# Altium schematic sheet STM32.SchDoc
size B
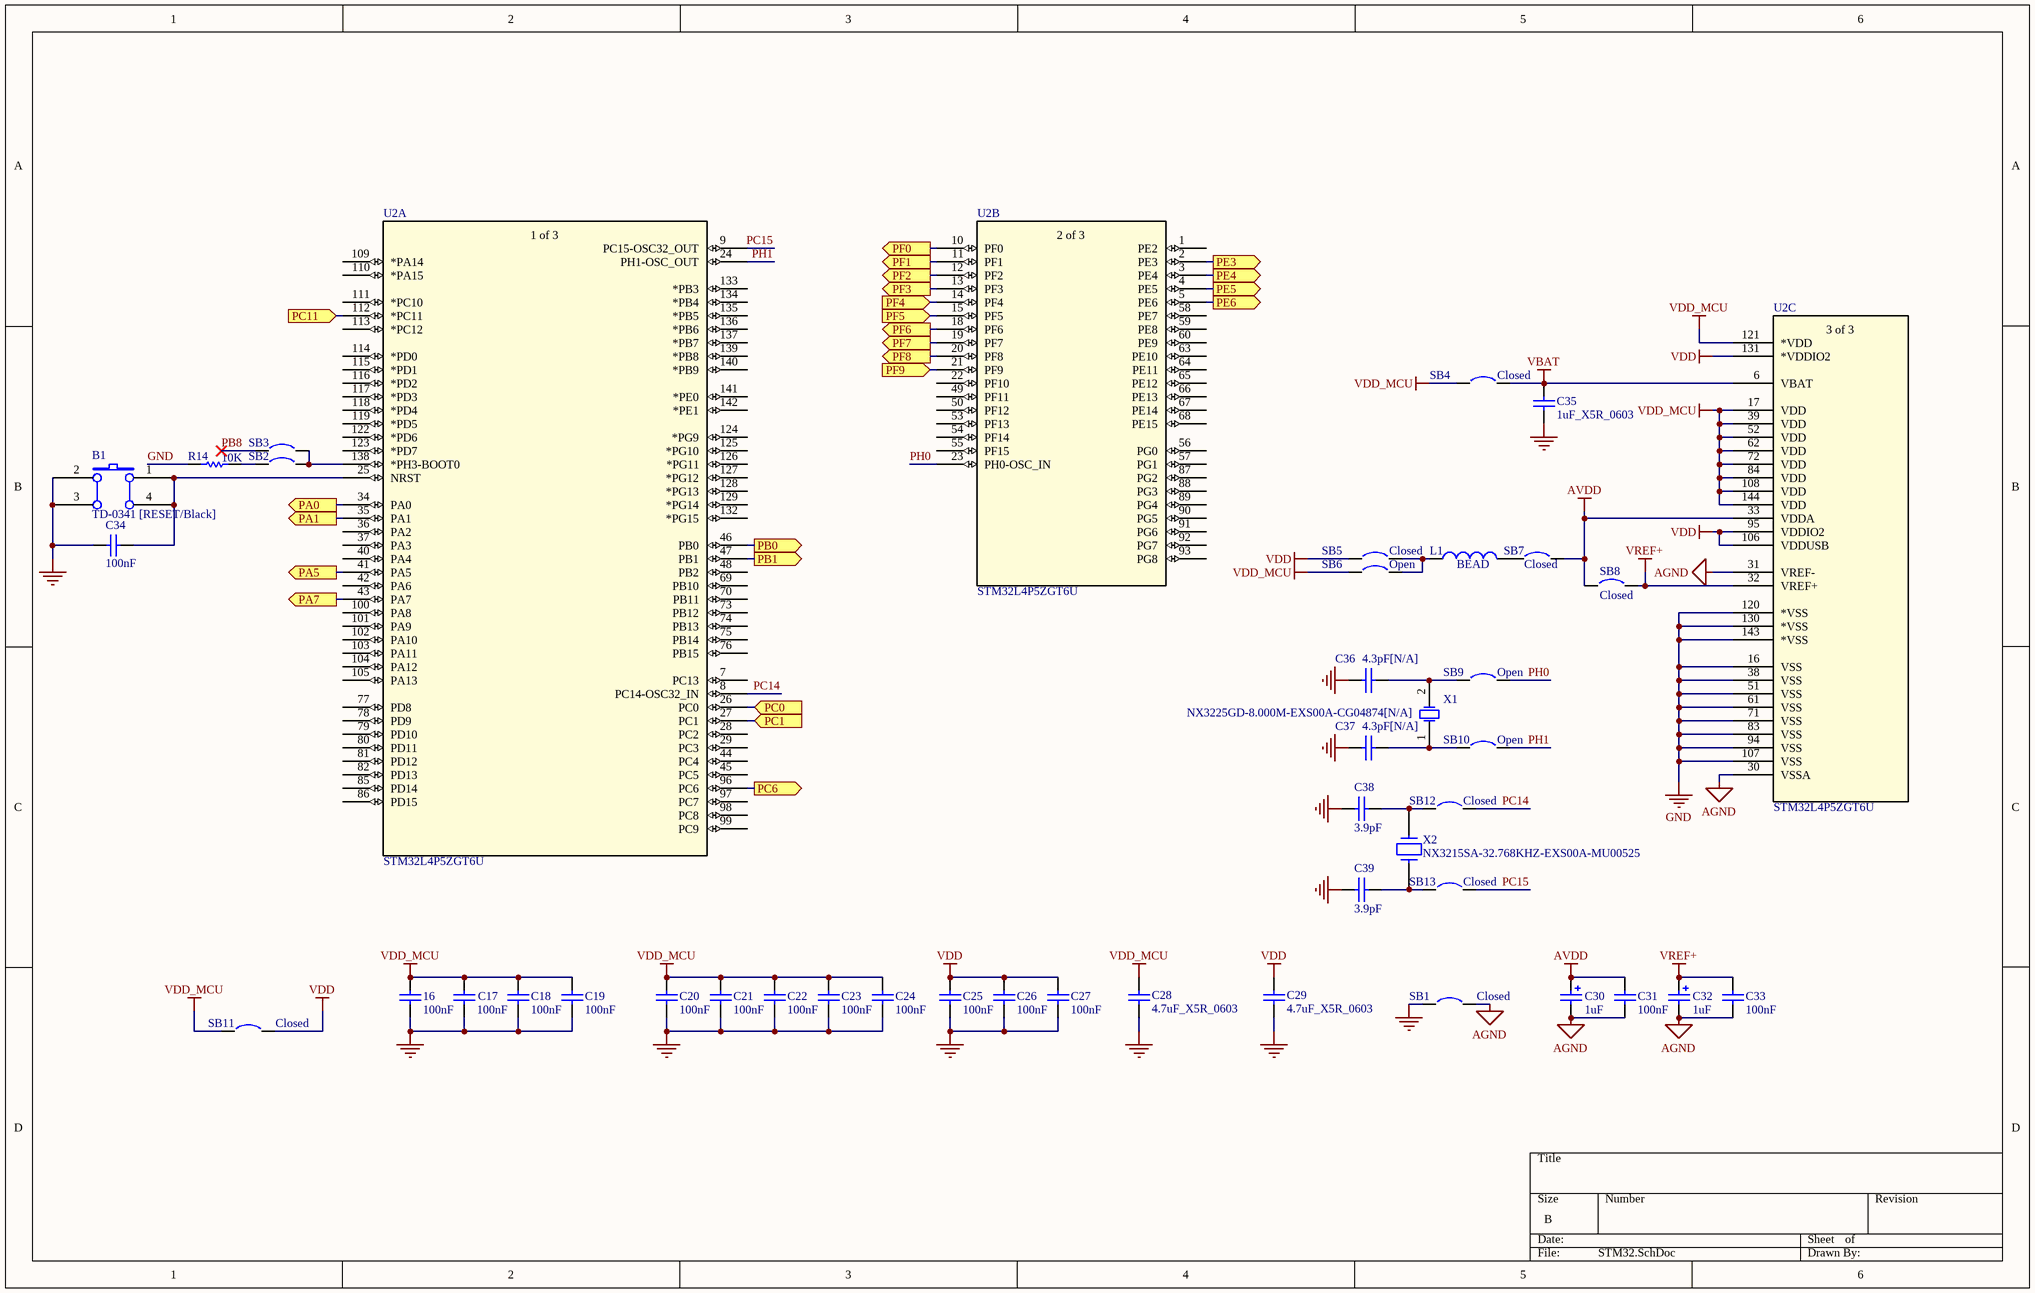
[diagram p0: STM32.SchDoc]

## Parts
16  100nF  [0603C]
B1  TD-0341 [RESET/Black]  [PB-6X6mm-Black]
C17  100nF  [0603C]
C18  100nF  [0603C]
C19  100nF  [0603C]
C20  100nF  [0603C]
C21  100nF  [0603C]
C22  100nF  [0603C]
C23  100nF  [0603C]
C24  100nF  [0603C]
C25  100nF  [0603C]
C26  100nF  [0603C]
C27  100nF  [0603C]
C28  4.7uF_X5R_0603  [0603C]
C29  4.7uF_X5R_0603  [0603C]
C30  value 1uF  [TAN-A]  (hidden comment: TAJA105K016R)
C31  100nF  [0603C]
C32  value 1uF  [TAN-A]  (hidden comment: TAJA105K016R)
C33  100nF  [0603C]
C34  100nF  [0603C]
C35  1uF_X5R_0603  [0603C]
C36  4.3pF[N/A]  [0603C]
C37  4.3pF[N/A]  [0603C]
C38  3.9pF  [0603C]
C39  3.9pF  [0603C]
L1  BEAD  [0603L]
R14  10K  [0603R]
SB1  Closed  [SB_0603]
SB2  Circuit Breaker  [SB_0603]  (value not drawn)
SB3  Circuit Breaker  [SB_0603]  (value not drawn)
SB4  Closed  [SB_0603]
SB5  Closed  [SB_0603]
SB6  Open  [SB_0603]
SB7  Closed  [SB_0603]
SB8  Closed  [SB_0603]
SB9  Open  [SB_0603]
SB10  Open  [SB_0603]
SB11  Closed  [SB_0603]
SB12  Closed  [SB_0603]
SB13  Closed  [SB_0603]
U2  STM32L4P5ZGT6U  [LQFP144_STM32_STM]  (parts A,B,C of 3)
X1  NX3225GD-8.000M-EXS00A-CG04874[N/A]  [OSC_2SM_3R2x2R5]
X2  NX3215SA-32.768KHZ-EXS00A-MU00525  [XTAL_2SM_3R2X1R5]

## Ports
PA0 (out), PA1 (out), PA5 (out), PA7 (out), PB0 (out), PB1 (out), PC0 (in), PC1 (in), PC6 (out), PC11 (in), PE3 (out), PE4 (out), PE5 (out), PE6 (out), PF0 (out), PF1 (out), PF2 (out), PF3 (out), PF4 (in), PF5 (in), PF6 (out), PF7 (out), PF8 (out), PF9 (in)

## Nets
AGND: C30.2 C31.2 C32.2 C33.2 SB1.2 U2.30(VSSA) U2.31(VREF-)
AVDD: C30.1 C31.1 SB7.2 SB8.1 U2.33(VDDA)
GND: 16.2 B1.2(B0) B1.3(B1) C17.2 C18.2 C19.2 C20.2 C21.2 C22.2 C23.2 C24.2 C25.2 C26.2 C27.2 C28.2 C29.2 C34.2 C35.2 C36.2 C37.2 C38.2 C39.2 R14.2 SB1.1 U2.16(VSS) U2.38(VSS) U2.51(VSS) U2.61(VSS) U2.71(VSS) U2.83(VSS) U2.94(VSS) U2.107(VSS) U2.120(*VSS) U2.130(*VSS) U2.143(*VSS)
VBAT: C35.1 SB4.2 U2.6(VBAT)
VDD: C25.1 C26.1 C27.1 C29.1 SB5.1 SB11.2 U2.95(VDDIO2) U2.106(VDDUSB) U2.131(*VDDIO2)
VDD_MCU: 16.1 C17.1 C18.1 C19.1 C20.1 C21.1 C22.1 C23.1 C24.1 C28.1 SB4.1 SB6.1 SB11.1 U2.17(VDD) U2.39(VDD) U2.52(VDD) U2.62(VDD) U2.72(VDD) U2.84(VDD) U2.108(VDD) U2.121(*VDD) U2.144(VDD)
VREF+: C32.1 C33.1 SB8.2 U2.32(VREF+)
PA0: U2.34(PA0) ; port PA0
PA1: U2.35(PA1) ; port PA1
PA5: U2.41(PA5) ; port PA5
PA7: U2.43(PA7) ; port PA7
PB0: U2.46(PB0) ; port PB0
PB1: U2.47(PB1) ; port PB1
PB8: SB3.1
PC0: U2.26(PC0) ; port PC0
PC1: U2.27(PC1) ; port PC1
PC6: U2.96(PC6) ; port PC6
PC11: U2.112(*PC11) ; port PC11
PC14: SB12.2 U2.8(PC14-OSC32_IN)
PC15: SB13.2 U2.9(PC15-OSC32_OUT)
PE3: U2.2(PE3) ; port PE3
PE4: U2.3(PE4) ; port PE4
PE5: U2.4(PE5) ; port PE5
PE6: U2.5(PE6) ; port PE6
PF0: U2.10(PF0) ; port PF0
PF1: U2.11(PF1) ; port PF1
PF2: U2.12(PF2) ; port PF2
PF3: U2.13(PF3) ; port PF3
PF4: U2.14(PF4) ; port PF4
PF5: U2.15(PF5) ; port PF5
PF6: U2.18(PF6) ; port PF6
PF7: U2.19(PF7) ; port PF7
PF8: U2.20(PF8) ; port PF8
PF9: U2.21(PF9) ; port PF9
PH0: SB9.2 U2.23(PH0-OSC_IN)
PH1: SB10.2 U2.24(PH1-OSC_OUT)
NetB1_1: B1.1(A0) B1.4(A1) C34.1 U2.25(NRST)
NetC36_1: C36.1 SB9.1 X1.2(OSC2)
NetC37_1: C37.1 SB10.1 X1.1(OSC1)
NetC38_1: C38.1 SB12.1 X2.1
NetC39_1: C39.1 SB13.1 X2.2
NetL1_1: L1.1 SB5.2 SB6.2
NetL1_2: L1.2 SB7.1
NetR14_1: R14.1 SB2.1
NetSB2_2: SB2.2 SB3.2 U2.138(*PH3-BOOT0)

Not connected (* = marked no-connect by the designer): U2 1(PE2) 7(PC13) 22(PF10) 28(PC2) 29(PC3) 36(PA2) 37(PA3) 40(PA4) 42(PA6) 44(PC4) 45(PC5) 48(PB2) 49(PF11) 50(PF12) 53(PF13) 54(PF14) 55(PF15) 56(PG0) 57(PG1) 58(PE7) 59(PE8) 60(PE9) 63(PE10) 64(PE11) 65(PE12) 66(PE13) 67(PE14) 68(PE15) 69(PB10) 70(PB11) 73(PB12) 74(PB13) 75(PB14) 76(PB15) 77(PD8) 78(PD9) 79(PD10) 80(PD11) 81(PD12) 82(PD13) 85(PD14) 86(PD15) 87(PG2) 88(PG3) 89(PG4) 90(PG5) 91(PG6) 92(PG7) 93(PG8) 97(PC7) 98(PC8) 99(PC9) 100(PA8) 101(PA9) 102(PA10) 103(PA11) 104(PA12) 105(PA13) 109(*PA14) 110(*PA15) 111(*PC10) 113(*PC12) 114(*PD0) 115(*PD1) 116(*PD2) 117(*PD3) 118(*PD4) 119(*PD5) 122(*PD6) 123(*PD7) 124(*PG9) 125(*PG10) 126(*PG11) 127(*PG12) 128(*PG13) 129(*PG14) 132(*PG15) 133(*PB3) 134(*PB4) 135(*PB5) 136(*PB6) 137(*PB7) 139(*PB8) 140(*PB9) 141(*PE0) 142(*PE1)

## Notes on the sheet
- (in symbol STM32L4P5ZGT6U, part A) 1 of 3
- (in symbol STM32L4P5ZGT6U, part B) 2 of 3
- (in symbol STM32L4P5ZGT6U, part C) 3 of 3

## Library data of the parts
16 C17-C27 C31 C33 = Cap: Capacitor; Value: 10nF; Published: 8-Jun-2000; Revision: July-2002: Re-released for DXP Platform.; Publisher: Altium Limited
B1 = SW PUSHBUTTON: SE PUSHBUTTON
C28 C29 = CAP SMD 0603  X5R 1µF 25V 10%: 0603  X5R 4.7uF; Value: 1µF; Rated voltage: 25V; Tolerance: 10%; Manufacturer: *; Manufacturer P/N: *; Order code Farnell: 1288202RL; Power: *; Technology: X5R; Temperature  Factor: *; Temperature Max: +125°C; Temperature Min: -55°C; STS Code: *
C30 C32 = Cap Pol1: Tan Capacitor,1uF,10%,16V,Tan-A,TAJA105K016R; Manuf_1: AVX; Ordered by: Subcon; ECCN_US/EU: NA; Published: 8-Jun-2000; Revision: July-2002: Re-released for DXP Platform.; Publisher: Altium Limited; Manuf_Part_1: TAJA105K016R
C34 = CAP: Capacitor; Value: 100pF; Published: 8-Jun-2000; Revision: July-2002: Re-released for DXP Platform.; Publisher: Altium Limited
C35 = CAP SMD 0603  X5R 1µF 25V 10%: 0603  X5R 1µF; Rated voltage: 25V; Tolerance: 10%; Manufacturer: *; Manufacturer P/N: *; Order code Farnell: 1288202RL; Value: 1µF; Power: *; Technology: X5R; Temperature  Factor: *; Temperature Max: +125°C; Temperature Min: -55°C; STS Code: *
C36-C39 = CAP: Capacitor
L1 = Inductor: Value: 100uH; Published: 8-Jun-2000; Revision: July-2002: Re-released for DXP Platform.; Publisher: Altium Limited
R14 = res1: Resistor; Value: 1K; Published: 8-Jun-2000; Revision: July-2002: Re-released for DXP Platform.; Publisher: Altium Limited
SB1 SB4 SB5 SB7 SB8 SB11 = Circuit Breaker_close: Circuit Breaker; Published: 24-Mar-1999; Revision: July-2002: Re-released for DXP Platform.; Publisher: Altium Limited
SB2 SB3 = Circuit Breaker: Solder: NO; Published: 24-Mar-1999; Revision: July-2002: Re-released for DXP Platform.; Publisher: Altium Limited
SB6 SB9 SB10 SB12 SB13 = Circuit Breaker: Published: 24-Mar-1999; Revision: July-2002: Re-released for DXP Platform.; Publisher: Altium Limited
U2 = STM32L4P5ZGT6U: No Description Available; Mfr_Name: STMicroelectronics; Copyright: Copyright (C) 2022 Ultra Librarian. All rights reserved.; Manufacturer_Part_Number: STM32L4P5ZGT6U; RefDes: RefDes; Type: DEV
X1 = XTAL: Crystal Oscillator; Published: 8-Jun-2000; LatestRevisionDate: 17-Jul-2002; LatestRevisionNote: Re-released for DXP Platform.; PackageReference: R38; Publisher: Altium Limited
X2 = CRYSTAL_32K: Crystal